# EAGLE design controlmodule-ra (EAGLE 9.6.2)
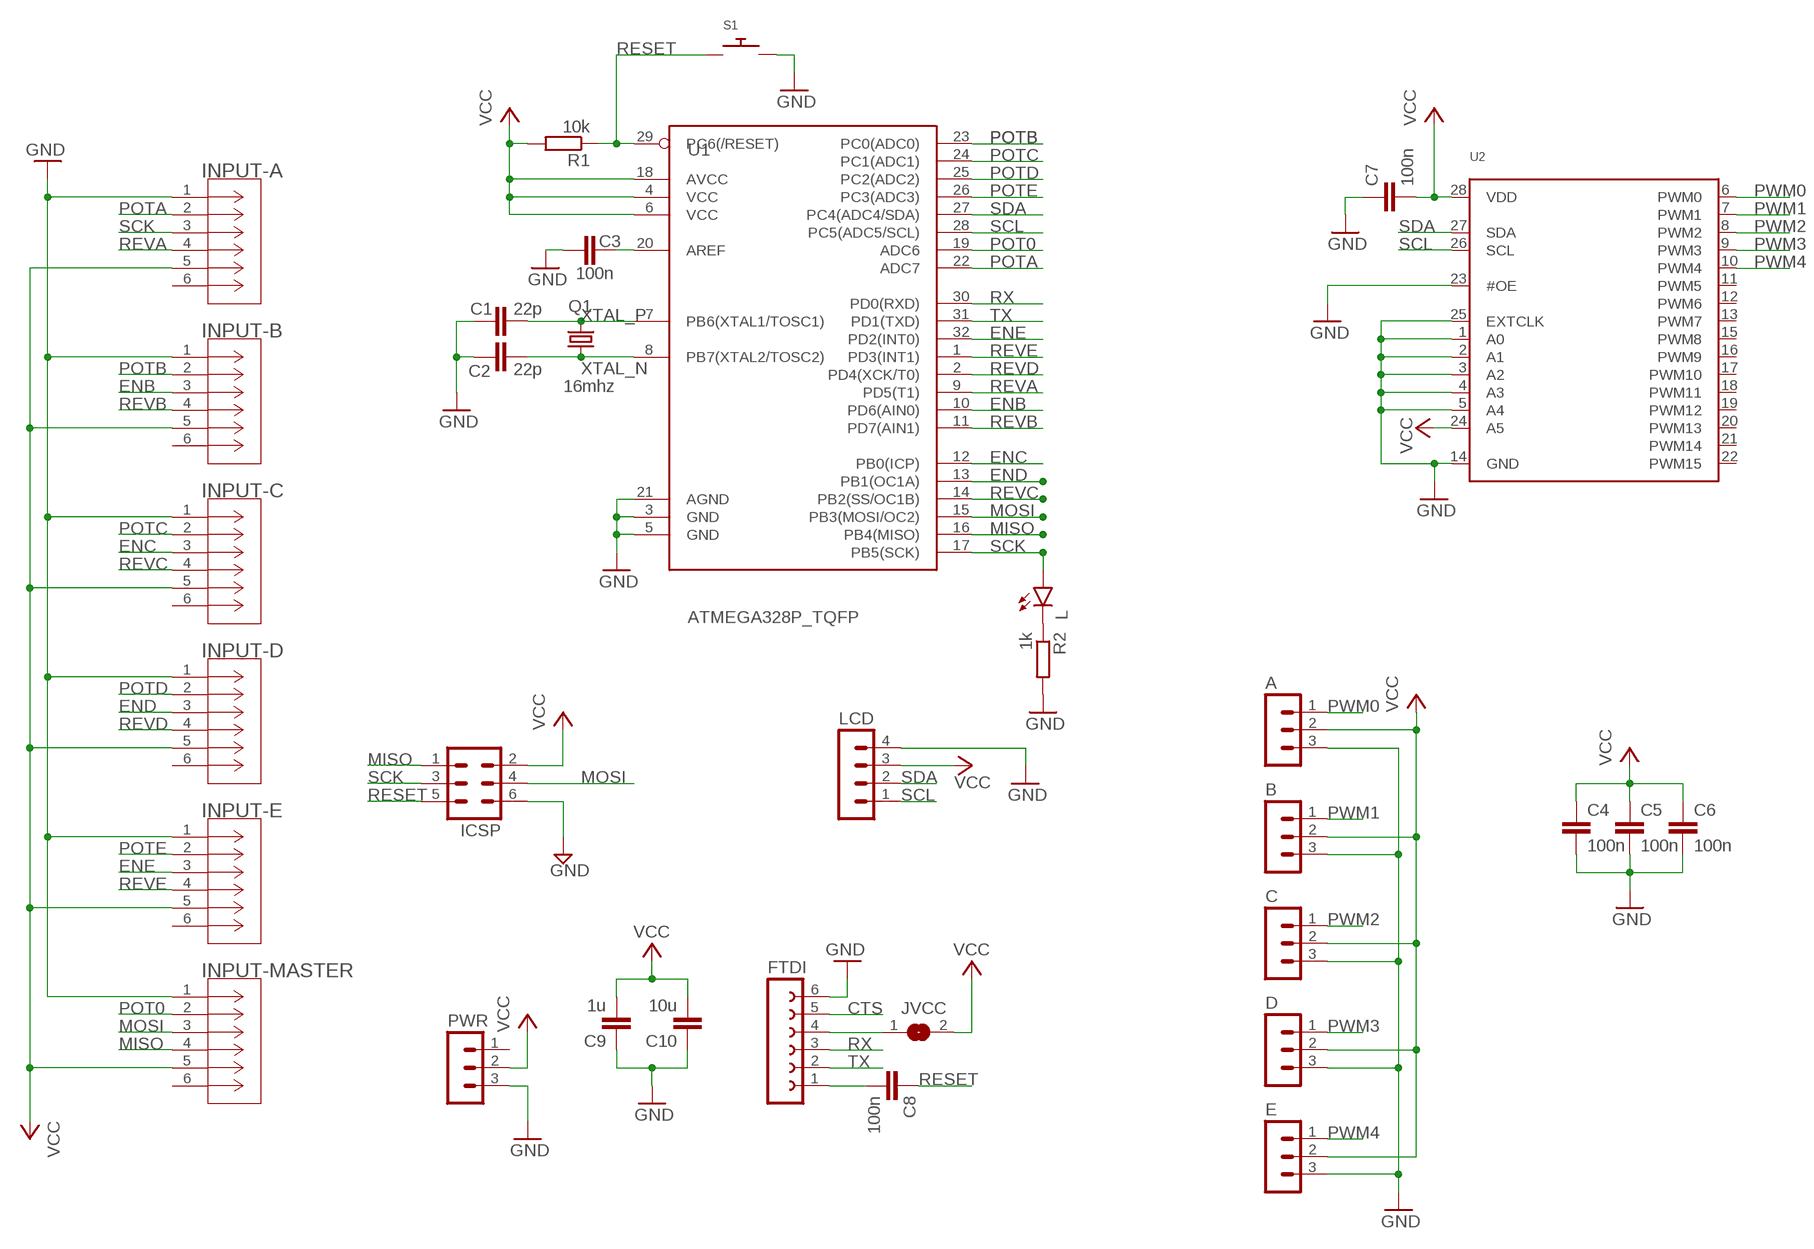
[diagram p0: schematic, sheet 1]

## Parts
A  MOLEX-SL-3PIN-RA-BOARD-LOCK  [MOLEX-SL-3PIN-RA-BOARD-LOCK]
B  MOLEX-SL-3PIN-RA-BOARD-LOCK  [MOLEX-SL-3PIN-RA-BOARD-LOCK]
C  MOLEX-SL-3PIN-RA-BOARD-LOCK  [MOLEX-SL-3PIN-RA-BOARD-LOCK]
C1  22p  C-EUC0805  [C0805]
C2  22p  C-EUC0805  [C0805]
C3  100n  C-EUC0805  [C0805]
C4  100n  C-EUC0805  [C0805]
C5  100n  C-EUC0805  [C0805]
C6  100n  C-EUC0805  [C0805]
C7  100n  C-EUC0805  [C0805]
C8  100n  C-EUC0805  [C0805]
C9  1u  C-EUC0805  [C0805]
C10  10u  C-EUC0805  [C0805]
D  MOLEX-SL-3PIN-RA-BOARD-LOCK  [MOLEX-SL-3PIN-RA-BOARD-LOCK]
E  MOLEX-SL-3PIN-RA-BOARD-LOCK  [MOLEX-SL-3PIN-RA-BOARD-LOCK]
FTDI  FE06-1  [FE06]
ICSP  MA03-2  [MA03-2]
INPUT-A  B6B-PH-K-S(LF)(SN)-JST  [CONN_B6B-PH-K-S_JST]
INPUT-B  B6B-PH-K-S(LF)(SN)-JST  [CONN_B6B-PH-K-S_JST]
INPUT-C  B6B-PH-K-S(LF)(SN)-JST  [CONN_B6B-PH-K-S_JST]
INPUT-D  B6B-PH-K-S(LF)(SN)-JST  [CONN_B6B-PH-K-S_JST]
INPUT-E  B6B-PH-K-S(LF)(SN)-JST  [CONN_B6B-PH-K-S_JST]
INPUT-MASTER  B6B-PH-K-S(LF)(SN)-JST  [CONN_B6B-PH-K-S_JST]
JVCC  SJ  [SJ]
L  LEDCHIP-LED0805  [CHIP-LED0805]
LCD  MOLEX-SL-4PIN-RA-BOARD-LOCK  [MOLEX-SL-4PIN-RA-BOARD-LOCK]
PWR  MOLEX-SL-3PIN-RA-BOARD-LOCK  [MOLEX-SL-3PIN-RA-BOARD-LOCK]
Q1  16mhz  CRYSTAL  [HC49UP]
R1  10k  R-EU_R0805  [R0805]
R2  1k  R-EU_R0805  [R0805]
S1  3X4MM-PUHSBUTTON  [3X4MM-PUSHBUTTON]
U1  ATMEGA328P_TQFP  [TQFP32-08]
U2  PCA9685  [TSSOP28]

## Nets
CTS: FTDI.5
ENB: INPUT-B.3 U1.10(PD6(AIN0))
ENC: INPUT-C.3 U1.12(PB0(ICP))
END: INPUT-D.3 U1.13(PB1(OC1A))
ENE: INPUT-E.3 U1.32(PD2(INT0))
GND: A.3 B.3 C1.1 C2.1 C3.2 C4.2 C5.2 C6.2 C7.1 C9.1 C10.1 C.3 D.3 E.3 FTDI.6 ICSP.6 INPUT-A.1 INPUT-B.1 INPUT-C.1 INPUT-D.1 INPUT-E.1 INPUT-MASTER.1 LCD.4 PWR.3 R2.2 S1.P$2 U1.3(GND) U1.5(GND) U1.21(AGND) U2.1(A0) U2.2(A1) U2.3(A2) U2.4(A3) U2.5(A4) U2.14(GND) U2.23(#OE) U2.25(EXTCLK)
MISO: ICSP.1 INPUT-MASTER.4 U1.16(PB4(MISO))
MOSI: ICSP.4 INPUT-MASTER.3 U1.15(PB3(MOSI/OC2))
N$1: FTDI.4 JVCC.1
N$3: L.C R2.1
N$8: C3.1 U1.20(AREF)
N$9: C8.2 FTDI.1
POT0: INPUT-MASTER.2 U1.19(ADC6)
POTA: INPUT-A.2 U1.22(ADC7)
POTB: INPUT-B.2 U1.23(PC0(ADC0))
POTC: INPUT-C.2 U1.24(PC1(ADC1))
POTD: INPUT-D.2 U1.25(PC2(ADC2))
POTE: INPUT-E.2 U1.26(PC3(ADC3))
PWM0: A.1 U2.6(PWM0)
PWM1: B.1 U2.7(PWM1)
PWM2: C.1 U2.8(PWM2)
PWM3: D.1 U2.9(PWM3)
PWM4: E.1 U2.10(PWM4)
RESET: C8.1 ICSP.5 R1.1 S1.P$1 U1.29(PC6(/RESET))
REVA: INPUT-A.4 U1.9(PD5(T1))
REVB: INPUT-B.4 U1.11(PD7(AIN1))
REVC: INPUT-C.4 U1.14(PB2(SS/OC1B))
REVD: INPUT-D.4 U1.2(PD4(XCK/T0))
REVE: INPUT-E.4 U1.1(PD3(INT1))
RX: FTDI.3 U1.30(PD0(RXD))
SCK: ICSP.3 INPUT-A.3 L.A U1.17(PB5(SCK))
SCL: LCD.1 U1.28(PC5(ADC5/SCL)) U2.26(SCL)
SDA: LCD.2 U1.27(PC4(ADC4/SDA)) U2.27(SDA)
TX: FTDI.2 U1.31(PD1(TXD))
VCC: A.2 B.2 C4.1 C5.1 C6.1 C7.2 C9.2 C10.2 C.2 D.2 E.2 ICSP.2 INPUT-A.5 INPUT-B.5 INPUT-C.5 INPUT-D.5 INPUT-E.5 INPUT-MASTER.5 JVCC.2 LCD.3 PWR.2 R1.2 U1.4(VCC) U1.6(VCC) U1.18(AVCC) U2.24(A5) U2.28(VDD)
XTAL_N: C2.2 Q1.1 U1.8(PB7(XTAL2/TOSC2))
XTAL_P: C1.2 Q1.2 U1.7(PB6(XTAL1/TOSC1))
Unconnected: INPUT-A.6 INPUT-B.6 INPUT-C.6 INPUT-D.6 INPUT-E.6 INPUT-MASTER.6 PWR.1 U2.11(PWM5) U2.12(PWM6) U2.13(PWM7) U2.15(PWM8) U2.16(PWM9) U2.17(PWM10) U2.18(PWM11) U2.19(PWM12) U2.20(PWM13) U2.21(PWM14) U2.22(PWM15)

## Library data of the parts
A B C D E PWR = bidpl:MOLEX-SL-3PIN-RA-BOARD-LOCK
C1-C10 = rcl:C-EU: CAPACITOR, European symbol; SPICEPREFIX: C
FTDI = bidpl:FE06-1: FEMALE HEADER
ICSP = bidpl:MA03-2: PIN HEADER
INPUT-A INPUT-B INPUT-C INPUT-D INPUT-E INPUT-MASTER = bidpl:B6B-PH-K-S(LF)(SN)-JST; BUILT_BY: EMA_Cory; COPYRIGHT: Copyright (C) 2018 Accelerated Designs. All rights reserved; DATASHEET: http://www.jst-mfg.com/product/pdf/eng/ePH.pdf; MANUFACTURER_PART_NUMBER: B6B-PH-K-S(LF)(SN); SOURCELIBRARY: Add_to_database_2020-12-08; VENDOR: JST
JVCC = jumper:SJ: SMD solder JUMPER
L = led:LED: LED OSRAM: - CHIPLED LG R971, LG N971, LY N971, LG Q971, LY Q971, LO R971, LY R971 LH N974, LH R974 LS Q976, LO Q976, LY Q976 LO Q996 - Hyper CHIPLED LW Q18S LB Q993, LB Q99A, LB R99A - SideLED LS A670, LO A670, LY A670, LG A670, LP A670 LB A673, LV A673, LT A673, LW A673 LH A674 LY A675 LS A676, LA A676, LO A676, LY A676, LW A676 LS A679, LY A679, LG A679 - Hyper Micro SIDELED® LS Y876, LA Y876, LO Y876, LY Y876 LT Y87S - SmartLED LW L88C, LW L88S LB L89C, LB L89S, LG L890 LS L89K, LO L89K, LY L89K LS L896, LA L896, LO L896, LY L896 - TOPLED LS T670, LO T670, LY T670, LG T670, LP T670 LSG T670, LSP T670, LSY T670, LOP T670, LYG T670 LG T671, LOG T671, LSG T671 LB T673, LV T673, LT T673, LW T673 LH T674 LS T676, LA T676, LO T676, LY T676, LB T676, LH T676, LSB T676, LW T676 LB T67C, LV T67C, LT T67C, LS T67K, LO T67K, LY T67K, LW E67C LS E67B, LA E67B, LO E67B, LY E67B, LB E67C, LV E67C, LT E67C LW T67C LS T679, LY T679, LG T679 LS T770, LO T770, LY T770, LG T770, LP T770 LB T773, LV T773, LT T773, LW T773 LH T774 LS E675, LA E675, LY E675, LS T675 LS T776, LA T776, LO T776, LY T776, LB T776 LHGB T686 LT T68C, LB T68C - Hyper Mini TOPLED® LB M676 - Mini TOPLED Santana® LG M470 LS M47K, LO M47K, LY M47K Source: http://www.osram.convergy.de LUXEON: - LUMILED® LXK2-PW12-R00, LXK2-PW12-S00, LXK2-PW14-U00, LXK2-PW14-V00 LXK2-PM12-R00, LXK2-PM12-S00, LXK2-PM14-U00 LXK2-PE12-Q00, LXK2-PE12-R00, LXK2-PE12-S00, LXK2-PE14-T00, LXK2-PE14-U00 LXK2-PB12-K00, LXK2-PB12-L00, LXK2-PB12-M00, LXK2-PB14-N00, LXK2-PB14-P00, LXK2-PB14-Q00 LXK2-PR12-L00, LXK2-PR12-M00, LXK2-PR14-Q00, LXK2-PR14-R00 LXK2-PD12-Q00, LXK2-PD12-R00, LXK2-PD12-S00 LXK2-PH12-R00, LXK2-PH12-S00 LXK2-PL12-P00, LXK2-PL12-Q00, LXK2-PL12-R00 Source: www.luxeon.com KINGBRIGHT: KA-3528ASYC Source: www.kingbright.com
LCD = bidpl:MOLEX-SL-4PIN-RA-BOARD-LOCK
Q1 = bidpl:CRYSTAL: CRYSTAL
R1 R2 = rcl:R-EU_: RESISTOR, European symbol; SPICEPREFIX: R
S1 = bidpl:3X4MM-PUHSBUTTON: https://ae01.alicdn.com/kf/HTB1vkExQpXXXXbFXFXXq6xXFXXXk/10PCS-2Pin-SMD-Mini-Button-Switch-Phone-Side-Push-3X4MM-Micro-Button-Switch-used-for-key.jpg_960x960.jpg
U1 = bidpl:ATMEGA328P_TQFP: Popular 328P in QFP Storefront component: ATmega328 - TQFP <https://www.sparkfun.com/products/13448> (COM-13448) Datasheet <http://www.sparkfun.com/datasheets/Components/SMD/ATMega328.pdf> SparkFun Products SparkFun RedBoard - Programmed with Arduino <https://www.sparkfun.com/products/12757> (DEV-12757) Arduino Pro Mini 328 - 5V/16MHz <https://www.sparkfun.com/products/11113> (DEV-11113) Arduino Pro Mini 328 - 3.3V/8MHz <https://www.sparkfun.com/products/11114> (DEV-11114) SparkFun OpenLog <https://www.sparkfun.com/products/13712> (DEV-13712) SparkFun MicroView - OLED Arduino Module <https://www.sparkfun.com/products/12923> (DEV-12923) SparkFun Digital Sandbox <https://www.sparkfun.com/products/12651> (DEV-12651) SparkFun PicoBoard <https://www.sparkfun.com/products/11888> (WIG-11888) Arduino Fio <https://www.sparkfun.com/products/10116> (DEV-10116) LilyPad Arduino 328 Main Board <https://www.sparkfun.com/products/13342> (DEV-13342) SparkFun RedStick <https://www.sparkfun.com/products/13741> (DEV-13741) LilyPad MP3 <https://www.sparkfun.com/products/11013> (DEV-11013) LilyPad Arduino SimpleSnap <https://www.sparkfun.com/products/10941> (DEV-10941) SparkFun Stepoko <https://www.sparkfun.com/products/13899> (ROB-13899) SparkFun Geiger Counter <https://www.sparkfun.com/products/11345> (SEN-11345) SparkFun EL Sequencer <https://www.sparkfun.com/products/12781> (COM-12781) Arduino Pro 328 - 5V/16MHz <https://www.sparkfun.com/products/10915> (DEV-10915) CryptoCape <https://www.sparkfun.com/products/12773> (DEV-12773) SparkFun IR Thermometer Evaluation Board - MLX90614 <https://www.sparkfun.com/products/10740> (SEN-10740) SparkFun RedBot Mainboard <https://www.sparkfun.com/products/12097> (ROB-12097) Arduino Pro 328 - 3.3V/8MHz <https://www.sparkfun.com/products/10914> (DEV-10914) SparkFun Block for Intel® Edison - Arduino <https://www.sparkfun.com/products/13036> (DEV-13036) SparkFun Simon Says - Surface Mount Soldering Kit <https://www.sparkfun.com/products/10935> (KIT-10935) SparkFun 7-Segment Serial Display - Red <https://www.sparkfun.com/products/11441> (COM-11441) SparkFun 7-Segment Serial Display - White <https://www.sparkfun.com/products/11629> (COM-11629) SparkFun 7-Segment Serial Display - Yellow <https://www.sparkfun.com/products/11443> (COM-11443) SparkFun 7-Segment Serial Display - Kelly Green <https://www.sparkfun.com/products/11440> (COM-11440) SparkFun 7-Segment Serial Display - Blue <https://www.sparkfun.com/products/11442> (COM-11442) SparkFun OpenSegment Serial Display - 20mm (Blue) <https://www.sparkfun.com/products/11647> (COM-11647) SparkFun OpenSegment Serial Display - 20mm (Green) <https://www.sparkfun.com/products/11646> (COM-11646) SparkFun OpenSegment Serial Display - 20mm (White) <https://www.sparkfun.com/products/11648> (COM-11648) SparkFun OpenSegment Serial Display - 20mm (Red) <https://www.sparkfun.com/products/11644> (COM-11644) SparkFun OpenSegment Serial Display - 20mm (Yellow) <https://www.sparkfun.com/products/11645> (COM-11645) SparkFun OpenSegment Shield <https://www.sparkfun.com/products/13190> (DEV-13190); PROD_ID: IC-09069
U2 = bidpl:PCA9685: PCA9685 - 16 Channel 12-Bit I2C PWM Controller 5.0V tolerant 16 channel, 12-bit I2C PWM controller with 25mA per output (max. 400mA total) Digikey: 568-5931-1-ND

## Board
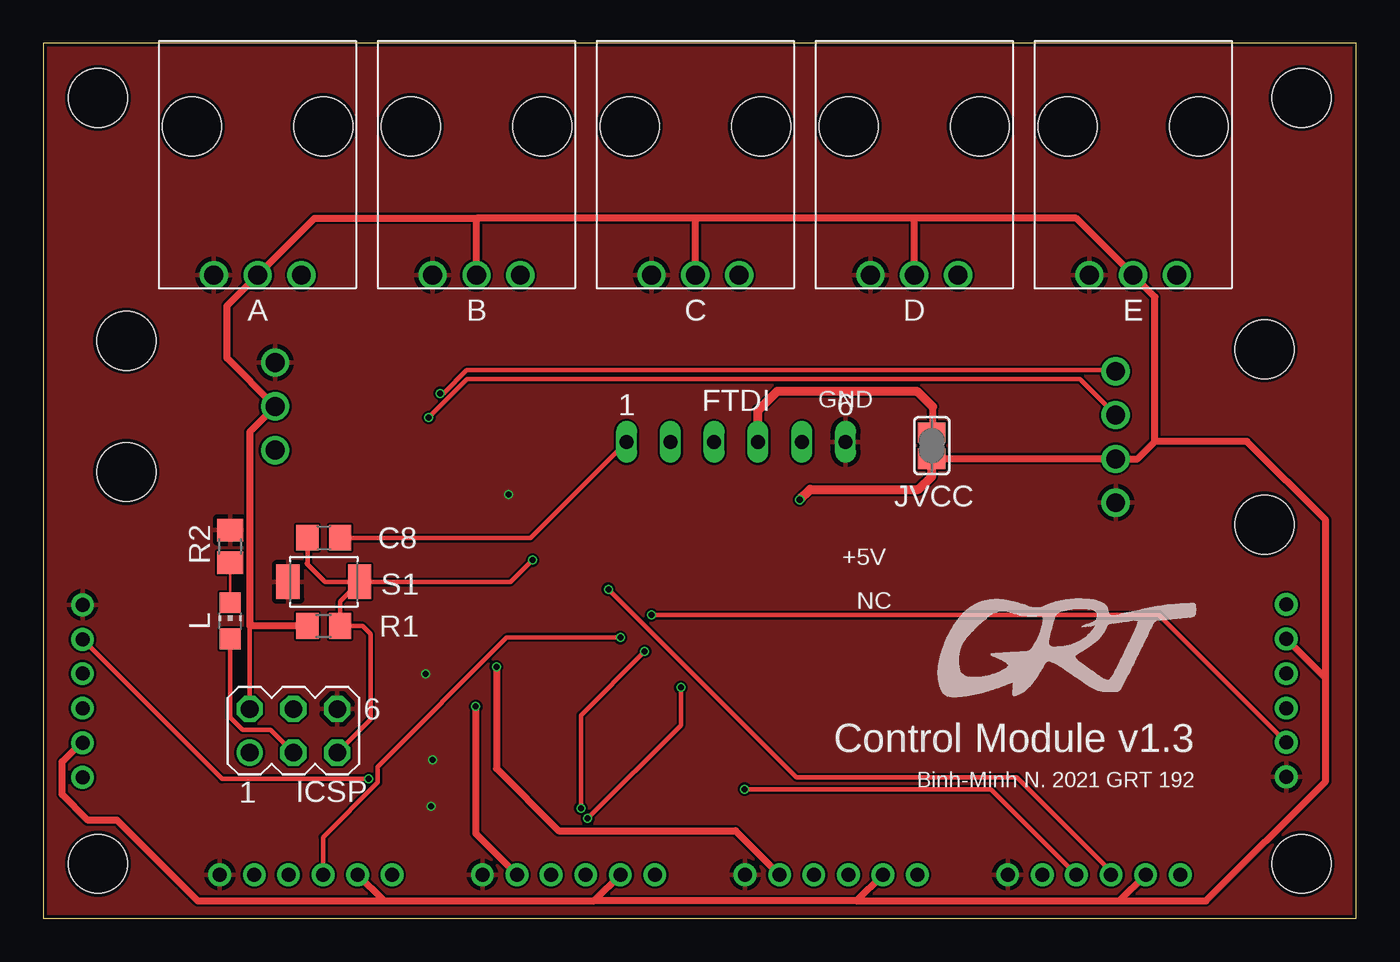
[diagram p1: board, top side]
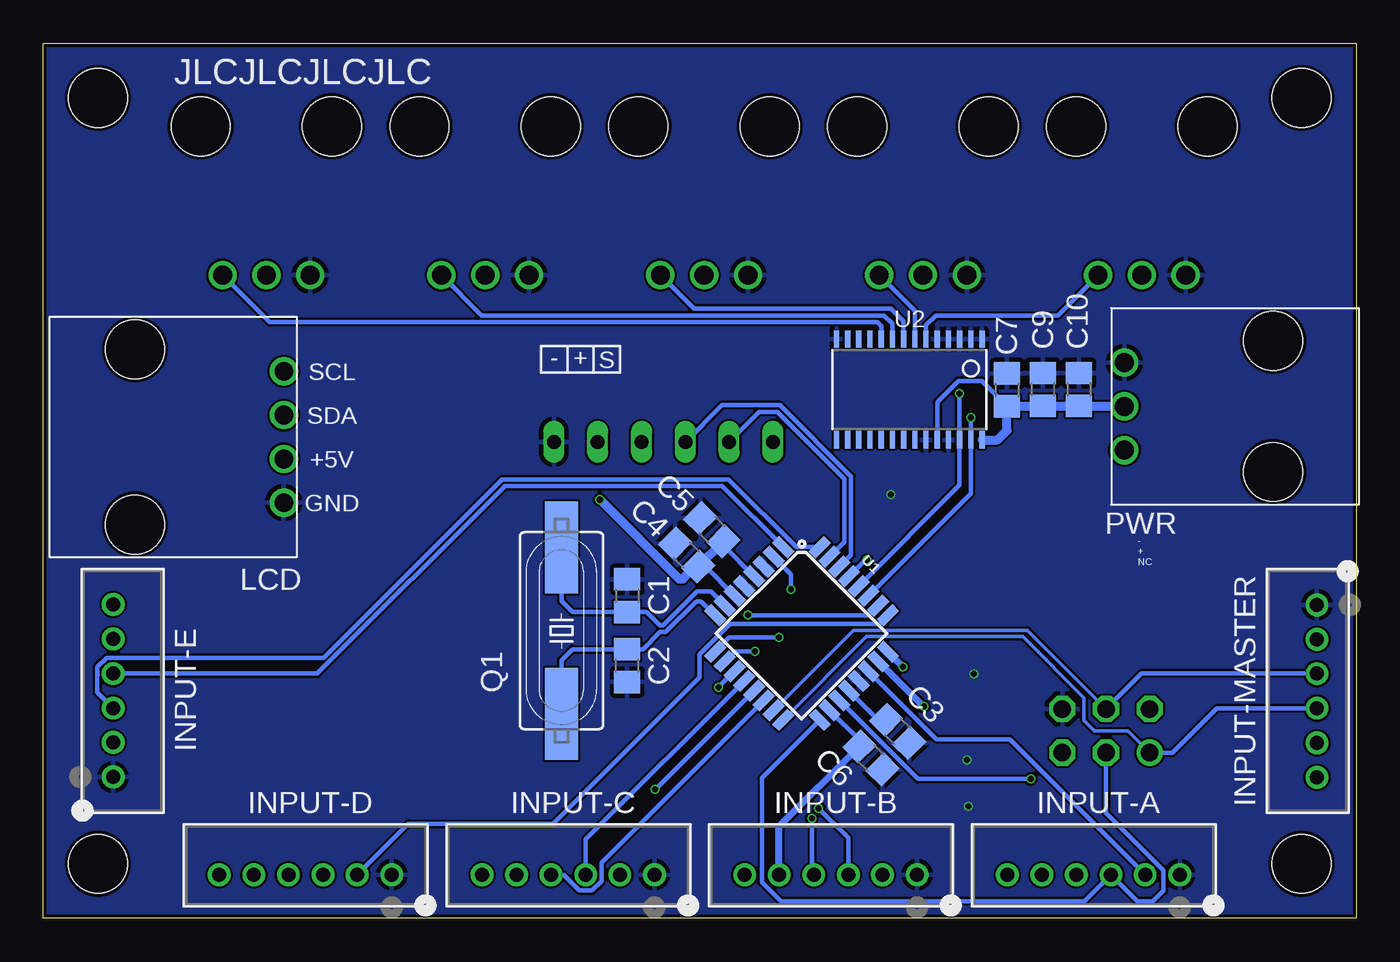
[diagram p2: board, bottom side, seen from below]

Size 76.2 x 50.8 mm. Coordinates in mm from the lower left corner, seen from the top.
Outline: 0,0 76.18,0 76.2,50.8 0,50.8 0,0
Copper layers (1*16): Top 0.035559375mm / dielectric 1.6mm / Bottom 0.035559375mm
Design rules "jlcpcb2layer": minimum track width 5mil, minimum drill 12mil, track to track 5mil, track to pad 5mil, pad to pad 5mil, via to via 5mil, smd to smd 5mil, copper to edge 8mil, drill to drill 6mil, minimum pad ring 5mil, minimum via ring 3mil, stop-mask expansion 2.5mil, vias tented up to drill 0mil, thermal gap 10mil
Holes 3.4 mm at 3.17,3.17 73.03,3.17 73.03,47.62 3.17,47.62

### Footprints (pad centres in the part's own frame; a part is rotated, then mirrored left to right if it is on the bottom)
MOLEX-SL-3PIN-RA-BOARD-LOCK = drill 1.092: 1 2.54,0; 2 0,0; 3 -2.54,0 | hole 3.404: -3.81,8.636; 3.81,8.636
C0805 = smd 1.3 x 1.5: 1 -0.95,0; 2 0.95,0
FE06 = drill 0.813 long: 1 -6.35,0; 2 -3.81,0; 3 -1.27,0; 4 1.27,0; 5 3.81,0; 6 6.35,0
MA03-2 = drill 1.016: 1 -2.54,-1.27 | drill 1.016 octagon: 2 -2.54,1.27; 3 0,-1.27; 4 0,1.27; 5 2.54,-1.27; 6 2.54,1.27
CONN_B6B-PH-K-S_JST = drill 0.813 pad 1.321: 1 -4.991,0; 2 -2.985,0; 3 -1.003,0; 4 1.003,0; 5 3.01,0; 6 5.016,0
SJ = smd 1.168 x 1.6: 1 -0.762,0; 2 0.762,0
CHIP-LED0805 = smd 1.2 x 1.2: A 0,-1.05; C 0,1.05
MOLEX-SL-4PIN-RA-BOARD-LOCK = drill 1.092: 1 3.81,0; 2 1.27,0; 3 -1.27,0; 4 -3.81,0 | hole 3.404: -5.08,8.636; 5.08,8.636
HC49UP = smd 5.334 x 1.93: 1 -4.826,0; 2 4.826,0
R0805 = smd 1.3 x 1.5: 1 -0.95,0; 2 0.95,0
3X4MM-PUSHBUTTON = smd 1.35 x 2: P$1 -2.075,0; P$2 2.075,0
TQFP32-08 = smd 1.27 x 0.559: 1 -4.293,2.8; 2 -4.293,2; 3 -4.293,1.2; 4 -4.293,0.4; 5 -4.293,-0.4; 6 -4.293,-1.2; 7 -4.293,-2; 8 -4.293,-2.8; 17 4.293,-2.8; 18 4.293,-2; 19 4.293,-1.2; 20 4.293,-0.4; 21 4.293,0.4; 22 4.293,1.2; 23 4.293,2; 24 4.293,2.8 | smd 0.559 x 1.27: 9 -2.8,-4.293; 10 -2,-4.293; 11 -1.2,-4.293; 12 -0.4,-4.293; 13 0.4,-4.293; 14 1.2,-4.293; 15 2,-4.293; 16 2.8,-4.293; 25 2.8,4.293; 26 2,4.293; 27 1.2,4.293; 28 0.4,4.293; 29 -0.4,4.293; 30 -1.2,4.293; 31 -2,4.293; 32 -2.8,4.293
TSSOP28 = smd 0.305 x 0.991: 1 -4.225,-2.918; 2 -3.575,-2.918; 3 -2.925,-2.918; 4 -2.275,-2.918; 5 -1.625,-2.918; 6 -0.975,-2.918; 7 -0.325,-2.918; 8 0.325,-2.918; 9 0.975,-2.918; 10 1.625,-2.918; 11 2.275,-2.918; 12 2.925,-2.918; 13 3.575,-2.918; 14 4.225,-2.918; 15 4.225,2.918; 16 3.575,2.918; 17 2.925,2.918; 18 2.275,2.918; 19 1.625,2.918; 20 0.975,2.918; 21 0.325,2.918; 22 -0.325,2.918; 23 -0.975,2.918; 24 -1.625,2.918; 25 -2.275,2.918; 26 -2.925,2.918; 27 -3.575,2.918; 28 -4.225,2.918

### Placement (x,y rotation side)
A  12.45,37.34 0 top
B  25.15,37.34 0 top
C  37.85,37.34 0 top
C1  42.31,18.73 270 bottom
C2  42.31,14.67 90 bottom
C3  26.62,10.86 315 bottom
C4  38.86,21.1 135 bottom
C5  37.4,22.56 135 bottom
C6  28.17,9.32 315 bottom
C7  20.27,30.68 270 bottom
C8  16.29,22.09 0 top
C9  18.2,30.7 270 bottom
C10  16.1,30.7 270 bottom
D  50.55,37.34 0 top
E  63.25,37.34 0 top
FTDI  40.21,27.66 0 top
ICSP  14.53,10.89 0 top
INPUT-A  15.24,2.54 180 bottom
INPUT-B  30.48,2.54 180 bottom
INPUT-C  45.72,2.54 180 bottom
INPUT-D  60.96,2.54 180 bottom
INPUT-E  72.14,13.21 90 bottom
INPUT-MASTER  2.29,13.21 270 bottom
JVCC  51.56,27.44 270 top
L  10.85,17.27 0 top
LCD  62.23,27.94 90 bottom
PWR  13.46,29.72 270 bottom
Q1  46.12,16.7 90 bottom
R1  16.29,16.97 180 top
R2  10.85,21.59 90 top
S1  16.29,19.53 180 top
U1  32.19,16.54 315 bottom
U2  25.95,30.7 180 bottom

### Tracks (layer width: path | path; a pad name or v marks a point on that pad's centre or on a via)
ENB  (via drill 0.35)
  Top 0.254: v31.2,6.4 31.2,11.8 v34.9,15.5
  Bottom 0.254: INPUT-B.3 29.48,4.68 v31.2,6.4 | v34.9,15.5 36.06,15.5 U1.10
ENC
  Bottom 0.254: U1.12 44.72,4.58 INPUT-C.3
END  (via drill 0.35)
  Top 0.254: v40.7,7.5 55,7.5 INPUT-D.3
  Bottom 0.254: U1.13 40.67,7.5 v40.7,7.5
ENE
  Bottom 0.254: U1.32 32.49,21.55 36.42,25.48 49.56,25.48 59.91,15.13 72.52,15.13 73.05,14.59 73.05,13.12 INPUT-E.3
GND  (via drill 0.35)
  other vias: 22.6,9.2 22.5,6.5 22.2,14.2 27,24.6
  pour Top: -0.51,-0.51 76.71,-0.51 76.71,51.05 -0.51,51.05
  pour Bottom: -1.27,50.8 -1.27,-2.07 77.47,-2.07 77.47,50.8
MISO
  Bottom 0.2: U1.16 28.42,16.36 26.8,16.36 19.36,16.36 15.8,12.8 15.8,11.5 15.2,10.9 13.26,10.9 ICSP.1
  Bottom 0.254: INPUT-MASTER.4 8.1,12.21 10.68,9.62 ICSP.1
MOSI
  Bottom 0.2: U1.15 29.18,16.72 19.08,16.72 ICSP.4
  Bottom 0.254: INPUT-MASTER.3 12.48,14.21 ICSP.4
N$1
  Top 0.406: 51.6,29.7 51.6,28.24 JVCC.1
  Top 0.508: FTDI.4 41.48,29.48 42.6,30.6 50.7,30.6 51.6,29.7
N$3
  Top 0.152: R2.1 L.C
N$8
  Bottom 0.254: U1.20 27.75,11.53 C3.1
N$9
  Top 0.254: C8.2 28.29,22.09 FTDI.1
POT0  (via drill 0.35)
  Top 0.254: v18.9,8.1 10.38,8.1 INPUT-MASTER.2
  Bottom 0.254: v18.9,8.1 25.45,8.1 U1.19
POTA
  Bottom 0.254: INPUT-A.2 20.12,10.4 24.36,10.4 U1.22
POTB  (via drill 0.35)
  Top 0.406: v25.1,12.3 25.1,4.94 INPUT-B.2
  Bottom 0.406: U1.23 25.13,12.3 v25.1,12.3
POTC  (via drill 0.35)
  Top 0.406: v26.3,14.6 26.3,8.7 29.9,5.1 40.17,5.1 INPUT-C.2
  Bottom 0.406: U1.24 v26.3,14.6
POTD
  Bottom 0.254: INPUT-D.2 55.02,5.5 46.6,5.5 38.11,13.99 38.11,15.34 36.34,17.1 27.67,17.1 U1.25
POTE  (via drill 0.35)
  Top 0.254: v35.3,17.62 64.74,17.62 INPUT-E.2
  Bottom 0.254: U1.26 28.3,17.6 35.3,17.6 v35.3,17.62
PWM0
  Bottom 0.254: U2.6 24.97,34.43 24.4,35 17.32,35 A.1
PWM1
  Bottom 0.254: U2.7 25.62,35.27 B.1
PWM2
  Bottom 0.254: U2.8 26.27,34.67 27,35.4 38.45,35.4 C.1
PWM3
  Bottom 0.254: U2.9 26.92,34.52 27.4,35 50.75,35 D.1
PWM4
  Bottom 0.254: U2.10 27.57,34.37 27.8,34.6 63.05,34.6 E.1
RESET  (via drill 0.35)
  Top 0.254: ICSP.5 19,11.56 19,16.5 18.53,16.97 R1.1 17.24,18.41 S1.P$1 | C8.1 15.34,20.64 15.3,20.6 16.37,19.53 S1.P$1 | S1.P$1 27.13,19.53 v28.4,20.8
  Bottom 0.254: v28.4,20.8 28.5,20.8 U1.29
REVA  (via drill 0.35)
  Top 0.254: v33.5,16.3 26.9,16.3 19.42,8.81 19.42,7.89 16.24,4.71 INPUT-A.4
  Bottom 0.254: v33.5,16.3 36.39,16.3 U1.9
REVB  (via drill 0.35)
  Top 0.254: v37,13.4 37,11.2 v31.6,5.8
  Bottom 0.254: U1.11 37,13.43 v37,13.4 | v31.6,5.8 31.6,2.66 INPUT-B.4
REVC
  Bottom 0.254: U1.14 43.8,3.23 43.8,2.16 44.34,1.63 45.09,1.63 46.01,2.54 INPUT-C.4
REVD  (via drill 0.35)
  Top 0.254: INPUT-D.4 61.96,2.74 56.5,8.2 43.7,8.2 v32.8,19.1
  Bottom 0.254: U1.2 32.8,19.97 v32.8,19.1
REVE
  Bottom 0.254: INPUT-E.4 60.29,14.21 49.4,25.1 36.8,25.1 U1.1
RX
  Bottom 0.254: FTDI.3 36.81,29.78 33.44,29.78 29.32,25.66 29.32,21.11 U1.30
SCK
  Top 0.254: ICSP.3 13.2,10.95 11.56,10.95 10.85,11.66 L.A
  Bottom 0.254: ICSP.3 14.53,6.13 11.2,2.8 11.2,1.6 11.8,1 12.7,1 INPUT-A.3 15.78,1 33.1,1 33.4,1 34.5,2.1 34.5,8.16 U1.17
SCL  (via drill 0.35)
  Top 0.254: LCD.1 62.16,31.82 24.58,31.82 23.23,30.46 v23.04,30.46
  Bottom 0.254: U1.28 23.02,25.14 U2.26 23.02,30.45 v23.04,30.46
SDA  (via drill 0.35)
  Top 0.254: LCD.2 60.14,31.3 24.6,31.3 v22.37,29.07
  Bottom 0.254: U1.27 22.37,24.66 U2.27 v22.37,29.07
TX
  Bottom 0.254: U1.31 29.7,21.86 29.7,25.5 33.6,29.4 34.66,29.4 FTDI.2
VCC  (via drill 0.35)
  Top 0.254: ICSP.2 11.99,17 12.01,16.97
  Top 0.406: INPUT-B.5 31.97,1.02 | 47.21,1.02 31.97,1.02 | 47.21,1.02 INPUT-C.5 | 47.21,1.02 62.45,1.02 | 62.45,1.02 INPUT-D.5 | 62.45,1.02 67.47,1.02 74.42,7.97 74.42,13.93 | 74.42,13.93 INPUT-E.5 | 50.55,40.64 59.94,40.64 E.2 64.52,36.07 64.52,27.69 | 50.55,40.64 37.85,40.64 | 37.85,40.64 25.15,40.64 | D.2 50.55,40.64 | C.2 37.85,40.64 | 74.42,13.93 74.42,23.11 69.85,27.69 64.52,27.69 | B.2 25.15,40.64 | 25.15,40.64 15.75,40.64 A.2 10.67,35.56 10.67,32.51 PWR.2 11.99,28.24 11.99,17 | JVCC.2 LCD.3 63.5,26.67 64.52,27.69 | INPUT-MASTER.5 2.2,10.2 1.1,9.1 1.1,7.2 2.6,5.7 4.3,5.7 8.98,1.02 19.77,1.02 | 19.77,1.02 31.97,1.02 | 19.77,1.02 INPUT-A.5 | R1.2 12.01,16.97
  Top 0.508: v43.9,24.3 44.5,24.9 50.8,24.9 51.56,25.66 JVCC.2
  Bottom 0.152: C9.2 18.2,29.73 | C10.2 16.08,29.73 16,29.73
  Bottom 0.254: U1.18 28.84,10.35 C6.1 | U1.4 36.72,21.63 C5.1 | U1.6 37.78,20.42 C4.1 | 13.48,29.73 PWR.2 | C7.2 21.74,31.2 23.1,31.2 24.32,29.98 U2.24
  Bottom 0.406: INPUT-B.5 33.49,5.34 C6.1
  Bottom 0.508: 13.48,29.73 16,29.73 18.2,29.73 C7.2 20.27,28.33 20.82,27.78 U2.28 | C5.1 C4.1 38.38,20.42 39.1,19.7 39.3,19.7 v43.9,24.3 | C5.1
XTAL_N
  Bottom 0.254: Q1.1 46.12,14.98 45.48,15.62 C2.2 41.4,15.62 40.4,16.62 40.08,16.62 38.3,18.4 38.02,18.4 U1.8
XTAL_P
  Bottom 0.254: Q1.2 46.12,18.42 45.48,17.78 C1.2 41.18,17.78 40.4,17 40.24,17 38.27,18.97 37.45,18.97 U1.7

### Text on the board
tPlace: GND | +5V | NC | Control Module v1.3 | Binh-Minh N. 2021 GRT 192
bPlace: JLCJLCJLCJLC | + | - | S | SCL | SDA | +5V | GND | - / + / NC